# Altium schematic sheet fpga-bank1.SchDoc: CS - FPGA - Bank 1
size Letter; CheckedBy: J. Brinton; CompanyName: Signal Laboratories, Inc.; DrawnBy: J. Brinton; Engineer: J. Brinton; Address1: 3479 Edison Way; Address2: Menlo Park CA 94025; Address3: +1 (877) 778-8435; Address4: siglabs.com; Revision: 3; SheetNumber: 6; SheetTotal: 47
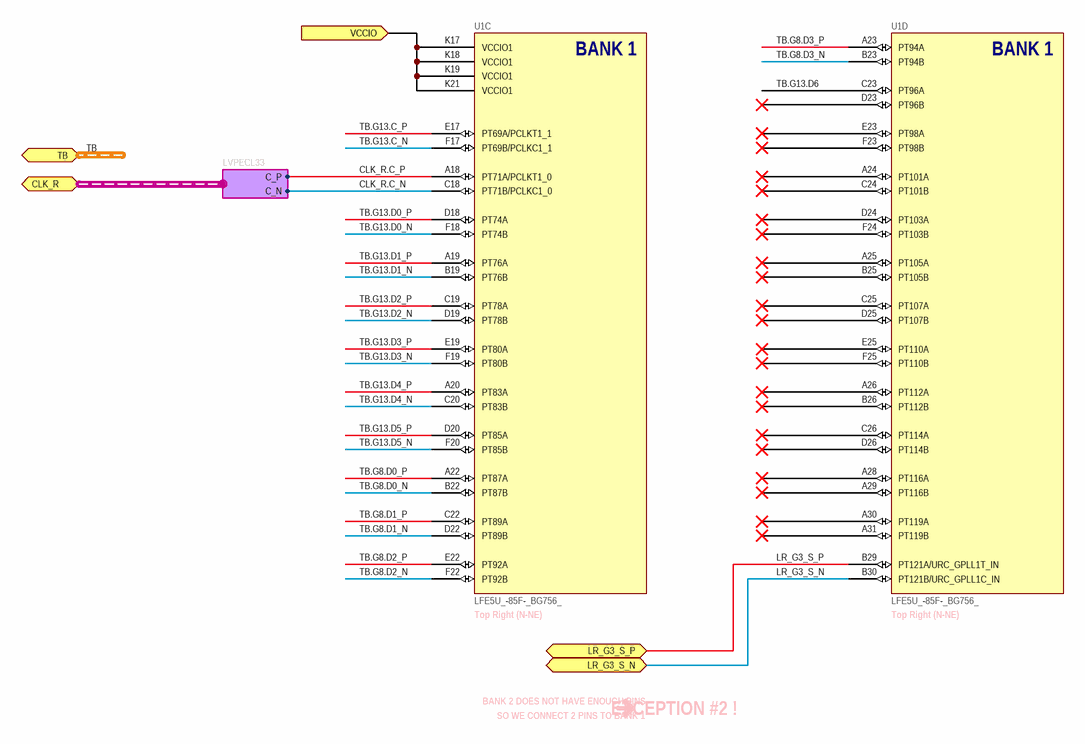
[diagram p0: fpga-bank1.SchDoc]

## Parts
U1  LFE5U_-85F-_BG756_  [caBGA756]  (parts C,D of 19)

## Ports
CLK_R (harness LVPECL33), LR_G3_S_N, LR_G3_S_P, TB (harness SDR), VCCIO (in)

## Harnesses
LVPECL33: C_P, C_N

## Nets
CLK_R.C_N: U1.C18(PT71B/PCLKC1_0) ; port CLK_R.C_N
CLK_R.C_P: U1.A18(PT71A/PCLKT1_0) ; port CLK_R.C_P
LR_G3_S_N: U1.B30(PT121B/URC_GPLL1C_IN) ; port LR_G3_S_N
LR_G3_S_P: U1.B29(PT121A/URC_GPLL1T_IN) ; port LR_G3_S_P
TB.G8.D0_N: U1.B22(PT87B)
TB.G8.D0_P: U1.A22(PT87A)
TB.G8.D1_N: U1.D22(PT89B)
TB.G8.D1_P: U1.C22(PT89A)
TB.G8.D2_N: U1.F22(PT92B)
TB.G8.D2_P: U1.E22(PT92A)
TB.G8.D3_N: U1.B23(PT94B)
TB.G8.D3_P: U1.A23(PT94A)
TB.G13.C_N: U1.F17(PT69B/PCLKC1_1)
TB.G13.C_P: U1.E17(PT69A/PCLKT1_1)
TB.G13.D0_N: U1.F18(PT74B)
TB.G13.D0_P: U1.D18(PT74A)
TB.G13.D1_N: U1.B19(PT76B)
TB.G13.D1_P: U1.A19(PT76A)
TB.G13.D2_N: U1.D19(PT78B)
TB.G13.D2_P: U1.C19(PT78A)
TB.G13.D3_N: U1.F19(PT80B)
TB.G13.D3_P: U1.E19(PT80A)
TB.G13.D4_N: U1.C20(PT83B)
TB.G13.D4_P: U1.A20(PT83A)
TB.G13.D5_N: U1.F20(PT85B)
TB.G13.D5_P: U1.D20(PT85A)
TB.G13.D6: U1.C23(PT96A)
VCCIO: U1.K17(VCCIO1) U1.K18(VCCIO1) U1.K19(VCCIO1) U1.K21(VCCIO1) ; port VCCIO

Not connected (* = marked no-connect by the designer): U1 A24(PT101A)* A25(PT105A)* A26(PT112A)* A28(PT116A)* A29(PT116B)* A30(PT119A)* A31(PT119B)* B25(PT105B)* B26(PT112B)* C24(PT101B)* C25(PT107A)* C26(PT114A)* D23(PT96B)* D24(PT103A)* D25(PT107B)* D26(PT114B)* E23(PT98A)* E25(PT110A)* F23(PT98B)* F24(PT103B)* F25(PT110B)*

## Buses and harness runs
harness TB = port TB

## Notes on the sheet
- (near U1) Top Right (N-NE)
- EXCEPTION #2 !
- BANK 2 DOES NOT HAVE ENOUGH PINS
- SO WE CONNECT 2 PINS TO BANK 1
- Title
- Engineer
- Revision
- Drawn By
- Checked By
- Date
- Sheet
- of
- (in symbol LFE5U_-85F-_BG756_, part C) BANK 1
- (in symbol LFE5U_-85F-_BG756_, part D) BANK 1

## Library data of the parts
U1 = LFE5U_-85F-_BG756_: ECP5 FPGA, 85k LUT, 756-caBGA; Manufacturer: Lattice Semiconductor; Manufacturer P/N: LFE5U_-85F-_BG756_